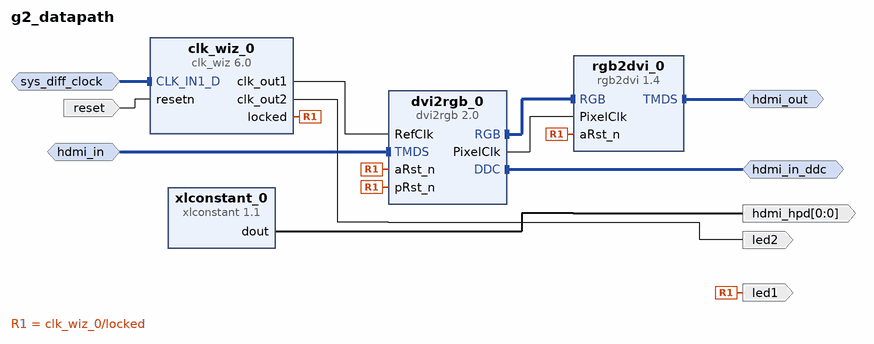
[diagram p0: block diagram of the top level]
# Vivado block design g2_datapath, xc7k325tffg900-2, Vivado 2021.2
create_bd_design g2_datapath

create_bd_intf_port -mode Slave -vlnv xilinx.com:interface:diff_clock_rtl:1.0 sys_diff_clock
set_property -dict {CONFIG.FREQ_HZ 200000000} [get_bd_intf_ports sys_diff_clock]
create_bd_intf_port -mode Slave -vlnv digilentinc.com:interface:tmds_rtl:1.0 hdmi_in
create_bd_intf_port -mode Master -vlnv xilinx.com:interface:iic_rtl:1.0 hdmi_in_ddc
create_bd_intf_port -mode Master -vlnv digilentinc.com:interface:tmds_rtl:1.0 hdmi_out
create_bd_port -dir I -type rst reset
set_property -dict {CONFIG.POLARITY ACTIVE_LOW} [get_bd_ports reset]
create_bd_port -dir O led1
create_bd_port -dir O led2
create_bd_port -dir O -from 0 -to 0 hdmi_hpd

create_bd_cell -type ip -vlnv xilinx.com:ip:clk_wiz:6.0 clk_wiz_0
set_property -dict [list \
  CONFIG.CLKOUT1_JITTER 98.146 \
  CONFIG.CLKOUT1_REQUESTED_OUT_FREQ 200.000 \
  CONFIG.CLKOUT2_JITTER 178.053 \
  CONFIG.CLKOUT2_PHASE_ERROR 89.971 \
  CONFIG.CLKOUT2_REQUESTED_OUT_FREQ 10.000 \
  CONFIG.CLKOUT2_USED true \
  CONFIG.CLK_IN1_BOARD_INTERFACE sys_diff_clock \
  CONFIG.MMCM_CLKOUT0_DIVIDE_F 5.000 \
  CONFIG.MMCM_CLKOUT1_DIVIDE 100 \
  CONFIG.NUM_OUT_CLKS 2 \
  CONFIG.RESET_BOARD_INTERFACE reset \
  CONFIG.RESET_PORT resetn \
  CONFIG.RESET_TYPE ACTIVE_LOW \
  CONFIG.USE_BOARD_FLOW true \
] [get_bd_cells clk_wiz_0]
create_bd_cell -type ip -vlnv digilentinc.com:ip:dvi2rgb:2.0 dvi2rgb_0
set_property -dict [list \
  CONFIG.IIC_BOARD_INTERFACE hdmi_in_ddc \
  CONFIG.TMDS_BOARD_INTERFACE hdmi_in \
  CONFIG.kClkRange 2 \
  CONFIG.kDebug false \
  CONFIG.kEdidFileName dgl_1080p_cea.data \
  CONFIG.kRstActiveHigh false \
] [get_bd_cells dvi2rgb_0]
create_bd_cell -type ip -vlnv digilentinc.com:ip:rgb2dvi:1.4 rgb2dvi_0
set_property -dict {CONFIG.TMDS_BOARD_INTERFACE hdmi_out CONFIG.kClkRange 1 CONFIG.kRstActiveHigh false} [get_bd_cells rgb2dvi_0]
create_bd_cell -type ip -vlnv xilinx.com:ip:xlconstant:1.1 xlconstant_0

# ---- connections ----

connect_bd_intf_net [get_bd_intf_ports hdmi_in_ddc] [get_bd_intf_pins dvi2rgb_0/DDC]
connect_bd_intf_net [get_bd_intf_pins dvi2rgb_0/RGB] [get_bd_intf_pins rgb2dvi_0/RGB]
connect_bd_intf_net [get_bd_intf_ports hdmi_in] [get_bd_intf_pins dvi2rgb_0/TMDS]
connect_bd_intf_net [get_bd_intf_ports hdmi_out] [get_bd_intf_pins rgb2dvi_0/TMDS]
connect_bd_intf_net [get_bd_intf_ports sys_diff_clock] [get_bd_intf_pins clk_wiz_0/CLK_IN1_D]
connect_bd_net [get_bd_pins clk_wiz_0/clk_out1] [get_bd_pins dvi2rgb_0/RefClk]
connect_bd_net [get_bd_pins clk_wiz_0/clk_out2] [get_bd_ports led2]
connect_bd_net [get_bd_pins clk_wiz_0/locked] \
  [get_bd_pins dvi2rgb_0/aRst_n] [get_bd_pins dvi2rgb_0/pRst_n] [get_bd_ports led1] [get_bd_pins rgb2dvi_0/aRst_n]
connect_bd_net [get_bd_pins dvi2rgb_0/PixelClk] [get_bd_pins rgb2dvi_0/PixelClk]
connect_bd_net [get_bd_ports reset] [get_bd_pins clk_wiz_0/resetn]
connect_bd_net [get_bd_pins xlconstant_0/dout] [get_bd_ports hdmi_hpd]

validate_bd_design
save_bd_design
